# Altium project SALO_LED_PCB.PrjPcb
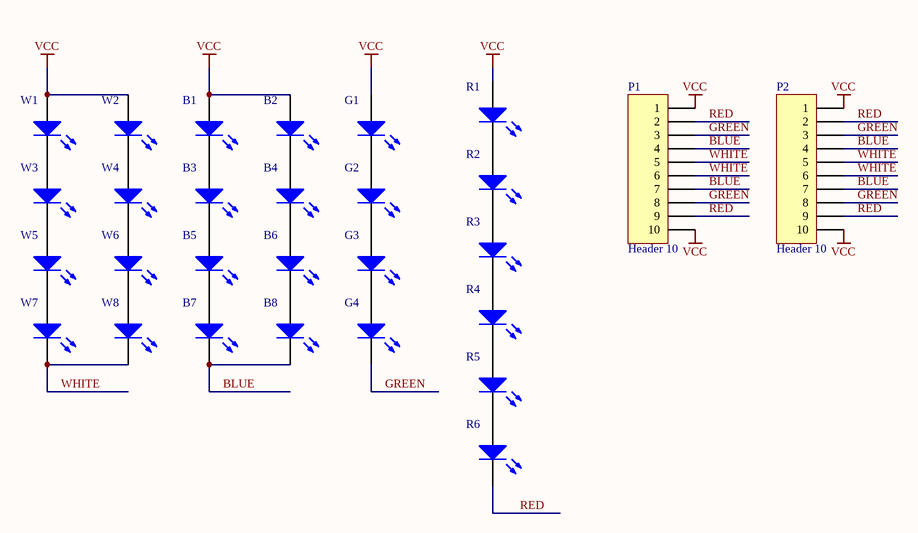
[diagram p0: salo_led_pcb.SchDoc]
1 sheet, 28 parts. Net scope: global (net labels, ports and power ports of the same name join across sheets).
Board file: salo_led_pcb.PcbDoc

## Sheet salo_led_pcb.SchDoc
size A

### Parts
B1  LED0  [1W LED]  (value not drawn)
B2  LED0  [1W LED]  (value not drawn)
B3  LED0  [1W LED]  (value not drawn)
B4  LED0  [1W LED]  (value not drawn)
B5  LED0  [1W LED]  (value not drawn)
B6  LED0  [1W LED]  (value not drawn)
B7  LED0  [1W LED]  (value not drawn)
B8  LED0  [1W LED]  (value not drawn)
G1  LED0  [1W LED]  (value not drawn)
G2  LED0  [1W LED]  (value not drawn)
G3  LED0  [1W LED]  (value not drawn)
G4  LED0  [1W LED]  (value not drawn)
P1  Header 10  [HDR1X10]
P2  Header 10  [HDR1X10]
R1  LED0  [1W LED]  (value not drawn)
R2  LED0  [1W LED]  (value not drawn)
R3  LED0  [1W LED]  (value not drawn)
R4  LED0  [1W LED]  (value not drawn)
R5  LED0  [1W LED]  (value not drawn)
R6  LED0  [1W LED]  (value not drawn)
W1  LED0  [1W LED]  (value not drawn)
W2  LED0  [1W LED]  (value not drawn)
W3  LED0  [1W LED]  (value not drawn)
W4  LED0  [1W LED]  (value not drawn)
W5  LED0  [1W LED]  (value not drawn)
W6  LED0  [1W LED]  (value not drawn)
W7  LED0  [1W LED]  (value not drawn)
W8  LED0  [1W LED]  (value not drawn)

### Nets
VCC: B1.1(A) B2.1(A) G1.1(A) P1.1 P1.10 P2.1 P2.10 R1.1(A) W1.1(A) W2.1(A)
BLUE: B7.2(K) B8.2(K) P1.4 P1.7 P2.4 P2.7
GREEN: G4.2(K) P1.3 P1.8 P2.3 P2.8
RED: P1.2 P1.9 P2.2 P2.9 R6.2(K)
WHITE: P1.5 P1.6 P2.5 P2.6 W7.2(K) W8.2(K)
NetB1_2: B1.2(K) B3.1(A)
NetB2_2: B2.2(K) B4.1(A)
NetB3_2: B3.2(K) B5.1(A)
NetB4_2: B4.2(K) B6.1(A)
NetB5_2: B5.2(K) B7.1(A)
NetB6_2: B6.2(K) B8.1(A)
NetG1_2: G1.2(K) G2.1(A)
NetG2_2: G2.2(K) G3.1(A)
NetG3_2: G3.2(K) G4.1(A)
NetR1_2: R1.2(K) R2.1(A)
NetR2_2: R2.2(K) R3.1(A)
NetR3_2: R3.2(K) R4.1(A)
NetR4_2: R4.2(K) R5.1(A)
NetR5_2: R5.2(K) R6.1(A)
NetW1_2: W1.2(K) W3.1(A)
NetW2_2: W2.2(K) W4.1(A)
NetW3_2: W3.2(K) W5.1(A)
NetW4_2: W4.2(K) W6.1(A)
NetW5_2: W5.2(K) W7.1(A)
NetW6_2: W6.2(K) W8.1(A)

### Library data of the parts
B1-B8 G1-G4 R1-R6 W1-W8 = LED0: Typical INFRARED GaAs LED; LatestRevisionDate: 08-Jul-2005
P1 P2 = Header 10: Header, 10-Pin; LatestRevisionDate: 17-Jul-2002; LatestRevisionNote: Re-released for DXP Platform.; Publisher: Altium Limited